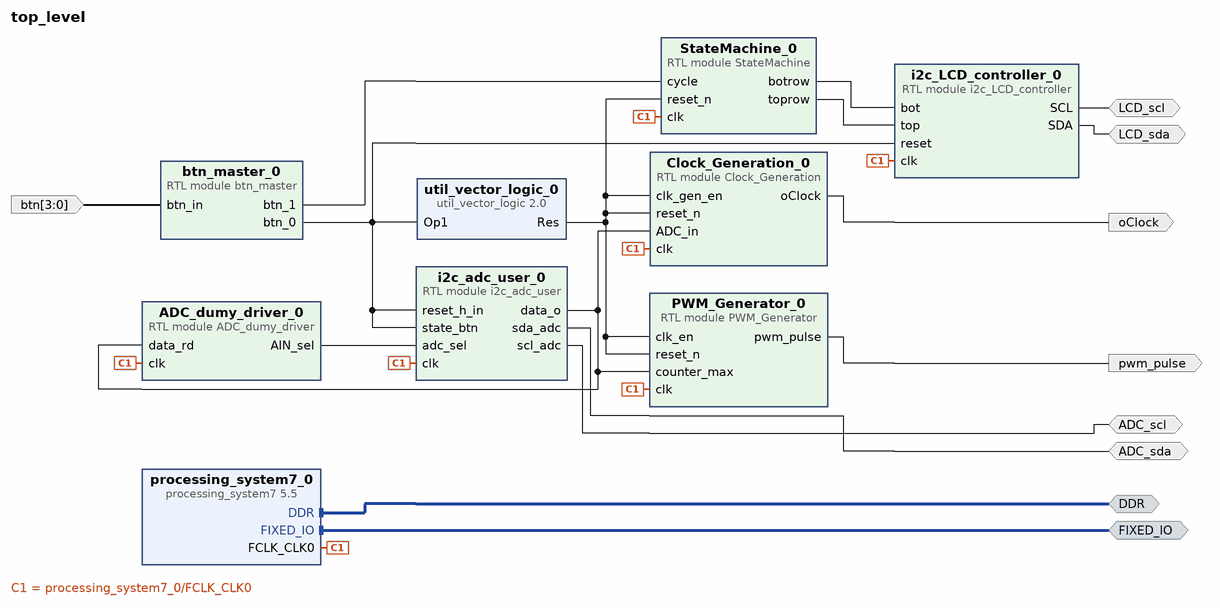
[diagram p0: block diagram of the top level]
# Vivado block design top_level, xc7z010clg225-1, Vivado 2022.2
create_bd_design top_level

create_bd_intf_port -mode Master -vlnv xilinx.com:interface:ddrx_rtl:1.0 DDR
create_bd_intf_port -mode Master -vlnv xilinx.com:display_processing_system7:fixedio_rtl:1.0 FIXED_IO
create_bd_port -dir IO ADC_sda
create_bd_port -dir IO ADC_scl
create_bd_port -dir IO LCD_scl
create_bd_port -dir IO LCD_sda
create_bd_port -dir O oClock
create_bd_port -dir O pwm_pulse
create_bd_port -dir I -from 3 -to 0 btn

create_bd_cell -type ip -vlnv xilinx.com:ip:processing_system7:5.5 processing_system7_0
set_property -dict [list \
  CONFIG.PCW_APU_PERIPHERAL_FREQMHZ 666.666666 \
  CONFIG.PCW_DM_WIDTH 2 \
  CONFIG.PCW_DQS_WIDTH 2 \
  CONFIG.PCW_DQ_WIDTH 16 \
  CONFIG.PCW_ENET0_PERIPHERAL_ENABLE 0 \
  CONFIG.PCW_FPGA0_PERIPHERAL_FREQMHZ 50 \
  CONFIG.PCW_FPGA1_PERIPHERAL_FREQMHZ 50 \
  CONFIG.PCW_GPIO_MIO_GPIO_ENABLE 0 \
  CONFIG.PCW_MIO_PRIMITIVE 32 \
  CONFIG.PCW_PERIPHERAL_BOARD_PRESET None \
  CONFIG.PCW_PRESET_BANK1_VOLTAGE {LVCMOS 3.3V} \
  CONFIG.PCW_QSPI_PERIPHERAL_ENABLE 0 \
  CONFIG.PCW_SD0_PERIPHERAL_ENABLE 0 \
  CONFIG.PCW_UART1_PERIPHERAL_ENABLE 1 \
  CONFIG.PCW_UART1_UART1_IO {MIO 8 .. 9} \
  CONFIG.PCW_UART_PERIPHERAL_FREQMHZ 100 \
  CONFIG.PCW_UIPARAM_DDR_BUS_WIDTH {16 Bit} \
  CONFIG.PCW_UIPARAM_DDR_FREQ_MHZ 533.333333 \
  CONFIG.PCW_UIPARAM_DDR_PARTNO {MT41J128M8 JP-125} \
  CONFIG.PCW_USB0_PERIPHERAL_ENABLE 0 \
  CONFIG.PCW_USE_M_AXI_GP0 0 \
] [get_bd_cells processing_system7_0]
# 326 more settings of processing_system7_0 are not shown: defaults, MIO pin electricals, DDR timing, and values the tool derives
create_bd_cell -type module -reference PWM_Generator PWM_Generator_0
create_bd_cell -type ip -vlnv xilinx.com:ip:util_vector_logic:2.0 util_vector_logic_0
set_property -dict {CONFIG.C_OPERATION not CONFIG.C_SIZE 1} [get_bd_cells util_vector_logic_0]
create_bd_cell -type module -reference i2c_adc_user i2c_adc_user_0
create_bd_cell -type module -reference ADC_dumy_driver ADC_dumy_driver_0
create_bd_cell -type module -reference Clock_Generation Clock_Generation_0
create_bd_cell -type module -reference i2c_LCD_controller i2c_LCD_controller_0
create_bd_cell -type module -reference StateMachine StateMachine_0
create_bd_cell -type module -reference btn_master btn_master_0

# ---- connections ----

connect_bd_intf_net [get_bd_intf_ports DDR] [get_bd_intf_pins processing_system7_0/DDR]
connect_bd_intf_net [get_bd_intf_ports FIXED_IO] [get_bd_intf_pins processing_system7_0/FIXED_IO]
connect_bd_net [get_bd_pins ADC_dumy_driver_0/AIN_sel] [get_bd_pins i2c_adc_user_0/adc_sel]
connect_bd_net [get_bd_pins Clock_Generation_0/oClock] [get_bd_ports oClock]
connect_bd_net [get_bd_ports LCD_scl] [get_bd_pins i2c_LCD_controller_0/SCL]
connect_bd_net [get_bd_ports ADC_sda] [get_bd_pins i2c_adc_user_0/sda_adc]
connect_bd_net [get_bd_ports ADC_scl] [get_bd_pins i2c_adc_user_0/scl_adc]
connect_bd_net [get_bd_ports LCD_sda] [get_bd_pins i2c_LCD_controller_0/SDA]
connect_bd_net [get_bd_pins PWM_Generator_0/pwm_pulse] [get_bd_ports pwm_pulse]
connect_bd_net [get_bd_pins StateMachine_0/botrow] [get_bd_pins i2c_LCD_controller_0/bot]
connect_bd_net [get_bd_pins StateMachine_0/toprow] [get_bd_pins i2c_LCD_controller_0/top]
connect_bd_net [get_bd_ports btn] [get_bd_pins btn_master_0/btn_in]
connect_bd_net [get_bd_pins btn_master_0/btn_0] \
  [get_bd_pins util_vector_logic_0/Op1] [get_bd_pins i2c_adc_user_0/reset_h_in] [get_bd_pins i2c_LCD_controller_0/reset] \
  [get_bd_pins i2c_adc_user_0/state_btn]
connect_bd_net [get_bd_pins btn_master_0/btn_1] [get_bd_pins StateMachine_0/cycle]
connect_bd_net [get_bd_pins i2c_adc_user_0/data_o] \
  [get_bd_pins PWM_Generator_0/counter_max] [get_bd_pins ADC_dumy_driver_0/data_rd] [get_bd_pins Clock_Generation_0/ADC_in]
connect_bd_net [get_bd_pins processing_system7_0/FCLK_CLK0] \
  [get_bd_pins PWM_Generator_0/clk] [get_bd_pins i2c_adc_user_0/clk] [get_bd_pins ADC_dumy_driver_0/clk] \
  [get_bd_pins Clock_Generation_0/clk] [get_bd_pins i2c_LCD_controller_0/clk] [get_bd_pins StateMachine_0/clk]
connect_bd_net [get_bd_pins util_vector_logic_0/Res] \
  [get_bd_pins PWM_Generator_0/reset_n] [get_bd_pins Clock_Generation_0/reset_n] [get_bd_pins StateMachine_0/reset_n] \
  [get_bd_pins Clock_Generation_0/clk_gen_en] [get_bd_pins PWM_Generator_0/clk_en]

validate_bd_design
save_bd_design
